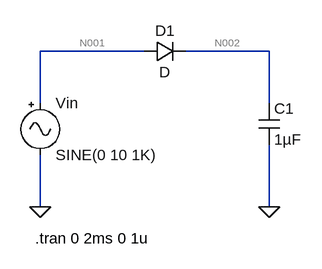
[diagram p0: schematic Prelab 5 - #2.asc]
Prelab 5 - #2.asc, the LTspice schematic file:
Version 4
SHEET 1 880 680
WIRE -160 80 -320 80
WIRE 32 80 -96 80
WIRE -320 160 -320 80
WIRE 32 160 32 80
WIRE -320 320 -320 240
WIRE 32 320 32 224
FLAG -320 320 0
FLAG 32 320 0
SYMBOL diode -160 96 R270
WINDOW 0 32 32 VTop 2
WINDOW 3 0 32 VBottom 2
SYMATTR InstName D1
SYMBOL Misc\\signal -320 144 R0
WINDOW 123 0 0 Left 0
WINDOW 39 0 0 Left 0
SYMATTR InstName Vin
SYMATTR Value SINE(0 10 1K)
SYMBOL cap 16 160 R0
SYMATTR InstName C1
SYMATTR Value 1µF
TEXT -328 368 Left 2 !.tran 0 2ms 0 1u

The netlist it stands for:
* Prelab 5 - #2.asc
D1 N001 N002 D
Vin N001 0 SINE(0 10 1K)
C1 N002 0 1µF
.model D D
.lib standard.dio
.tran 0 2ms 0 1u
.backanno
.end

* Results of the author's LTspice run, read from the files saved beside the schematic
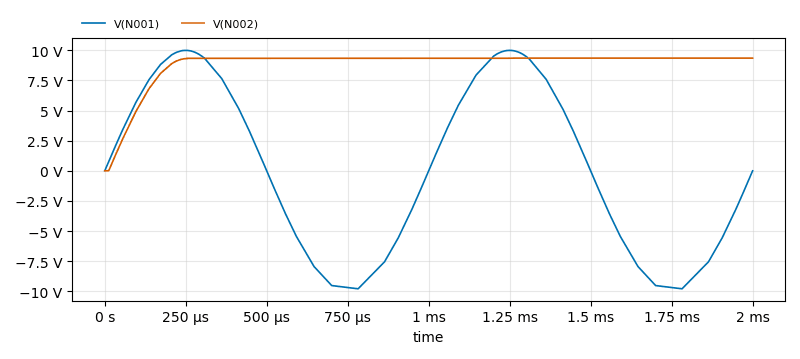
[diagram p1: Transient Analysis of Prelab 5 - #2.asc, plotted from the saved traces]
* Transient Analysis, 1 run:
*   V(N001): min -9.792 V, max 10 V, average 30.83 mV, rms 7.034 V, last 0 V
*   V(N002): min 0 V, max 9.357 V, average 8.88 V, rms 9.032 V, last 9.357 V